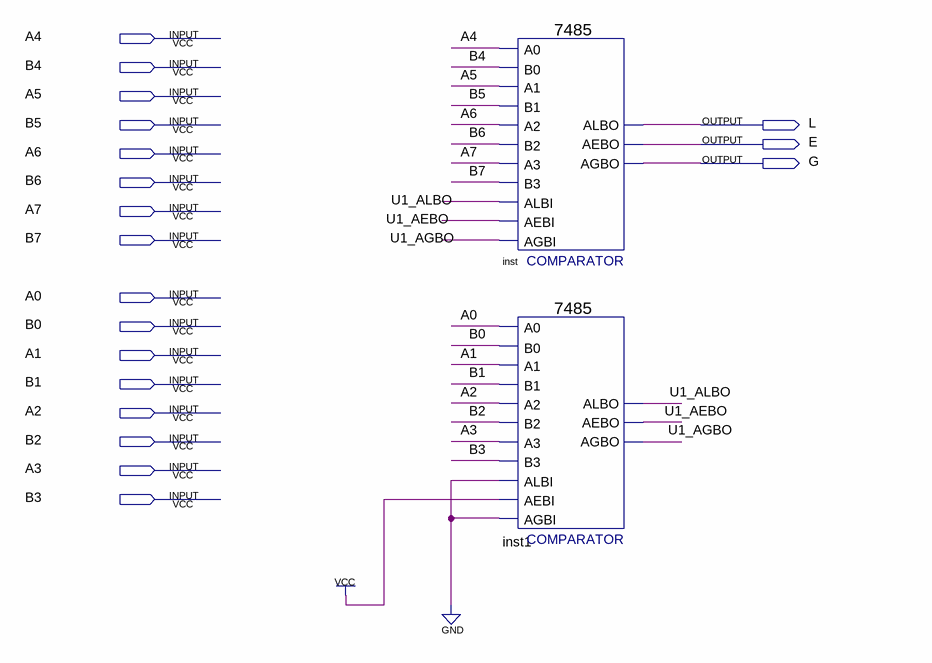
[diagram p0: schematic sheet]
// Quartus schematic eight_bit_compare_seven_four_eight_five.bdf as structural Verilog: 2 symbols, 19 pins
module eight_bit_compare_seven_four_eight_five (
  input  A4,
  input  B4,
  input  A5,
  input  B5,
  input  A6,
  input  B6,
  input  A7,
  input  B7,
  input  A0,
  input  B0,
  input  A1,
  input  B1,
  input  A2,
  input  B2,
  input  A3,
  input  B3,
  output L,
  output E,
  output G
);

  wire U1_AEBO, U1_AGBO, U1_ALBO;

  \7485  inst (
    .A3(A7), .B2(B6), .A2(A6), .AEBI(U1_AEBO), .AGBI(U1_AGBO), .ALBI(U1_ALBO), .A0(A4), .B0(B4), .B3(B7),
    .A1(A5), .B1(B5), .ALBO(L), .AGBO(G), .AEBO(E));
  \7485  inst1 (
    .A3(A3), .B2(B2), .A2(A2), .AEBI(1'b1), .AGBI(1'b0), .ALBI(1'b0), .A0(A0), .B0(B0), .B3(B3), .A1(A1),
    .B1(B1), .ALBO(U1_ALBO), .AGBO(U1_AGBO), .AEBO(U1_AEBO));
endmodule
